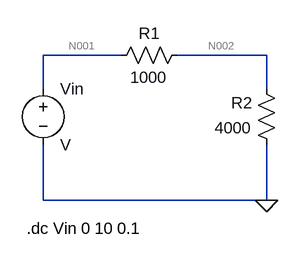
[diagram p0: schematic ELEN 115 Lab 1 Part 2.asc]
ELEN 115 Lab 1 Part 2.asc, the LTspice schematic file:
Version 4
SHEET 1 880 680
WIRE 176 64 64 64
WIRE 384 64 256 64
WIRE 64 112 64 64
WIRE 384 112 384 64
WIRE 64 272 64 192
WIRE 384 272 384 192
WIRE 384 272 64 272
FLAG 384 272 0
SYMBOL res 272 48 R90
WINDOW 0 0 56 VBottom 2
WINDOW 3 32 56 VTop 2
SYMATTR InstName R1
SYMATTR Value 1000
SYMBOL res 400 208 R180
WINDOW 0 36 76 Left 2
WINDOW 3 36 40 Left 2
SYMATTR InstName R2
SYMATTR Value 4000
SYMBOL voltage 64 96 R0
SYMATTR InstName Vin
TEXT 40 312 Left 2 !.dc Vin 0 10 0.1

The netlist it stands for:
* ELEN 115 Lab 1 Part 2.asc
R1 N002 N001 1000
R2 0 N002 4000
Vin N001 0 V
.dc Vin 0 10 0.1
.backanno
.end

* Results of the author's LTspice run, read from the files saved beside the schematic
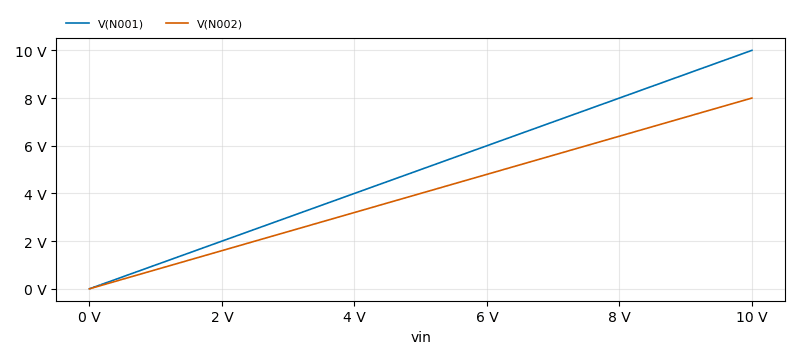
[diagram p1: DC transfer characteristic of ELEN 115 Lab 1 Part 2.asc, plotted from the saved traces]
* DC transfer characteristic, 1 run:
*   V(N001): 0 V at vin=0 V, 10 V at vin=10 V, min 0 V, max 10 V
*   V(N002): 0 V at vin=0 V, 8 V at vin=10 V, min 0 V, max 8 V